# EAGLE schematic tester1 (EAGLE 9.6.2)
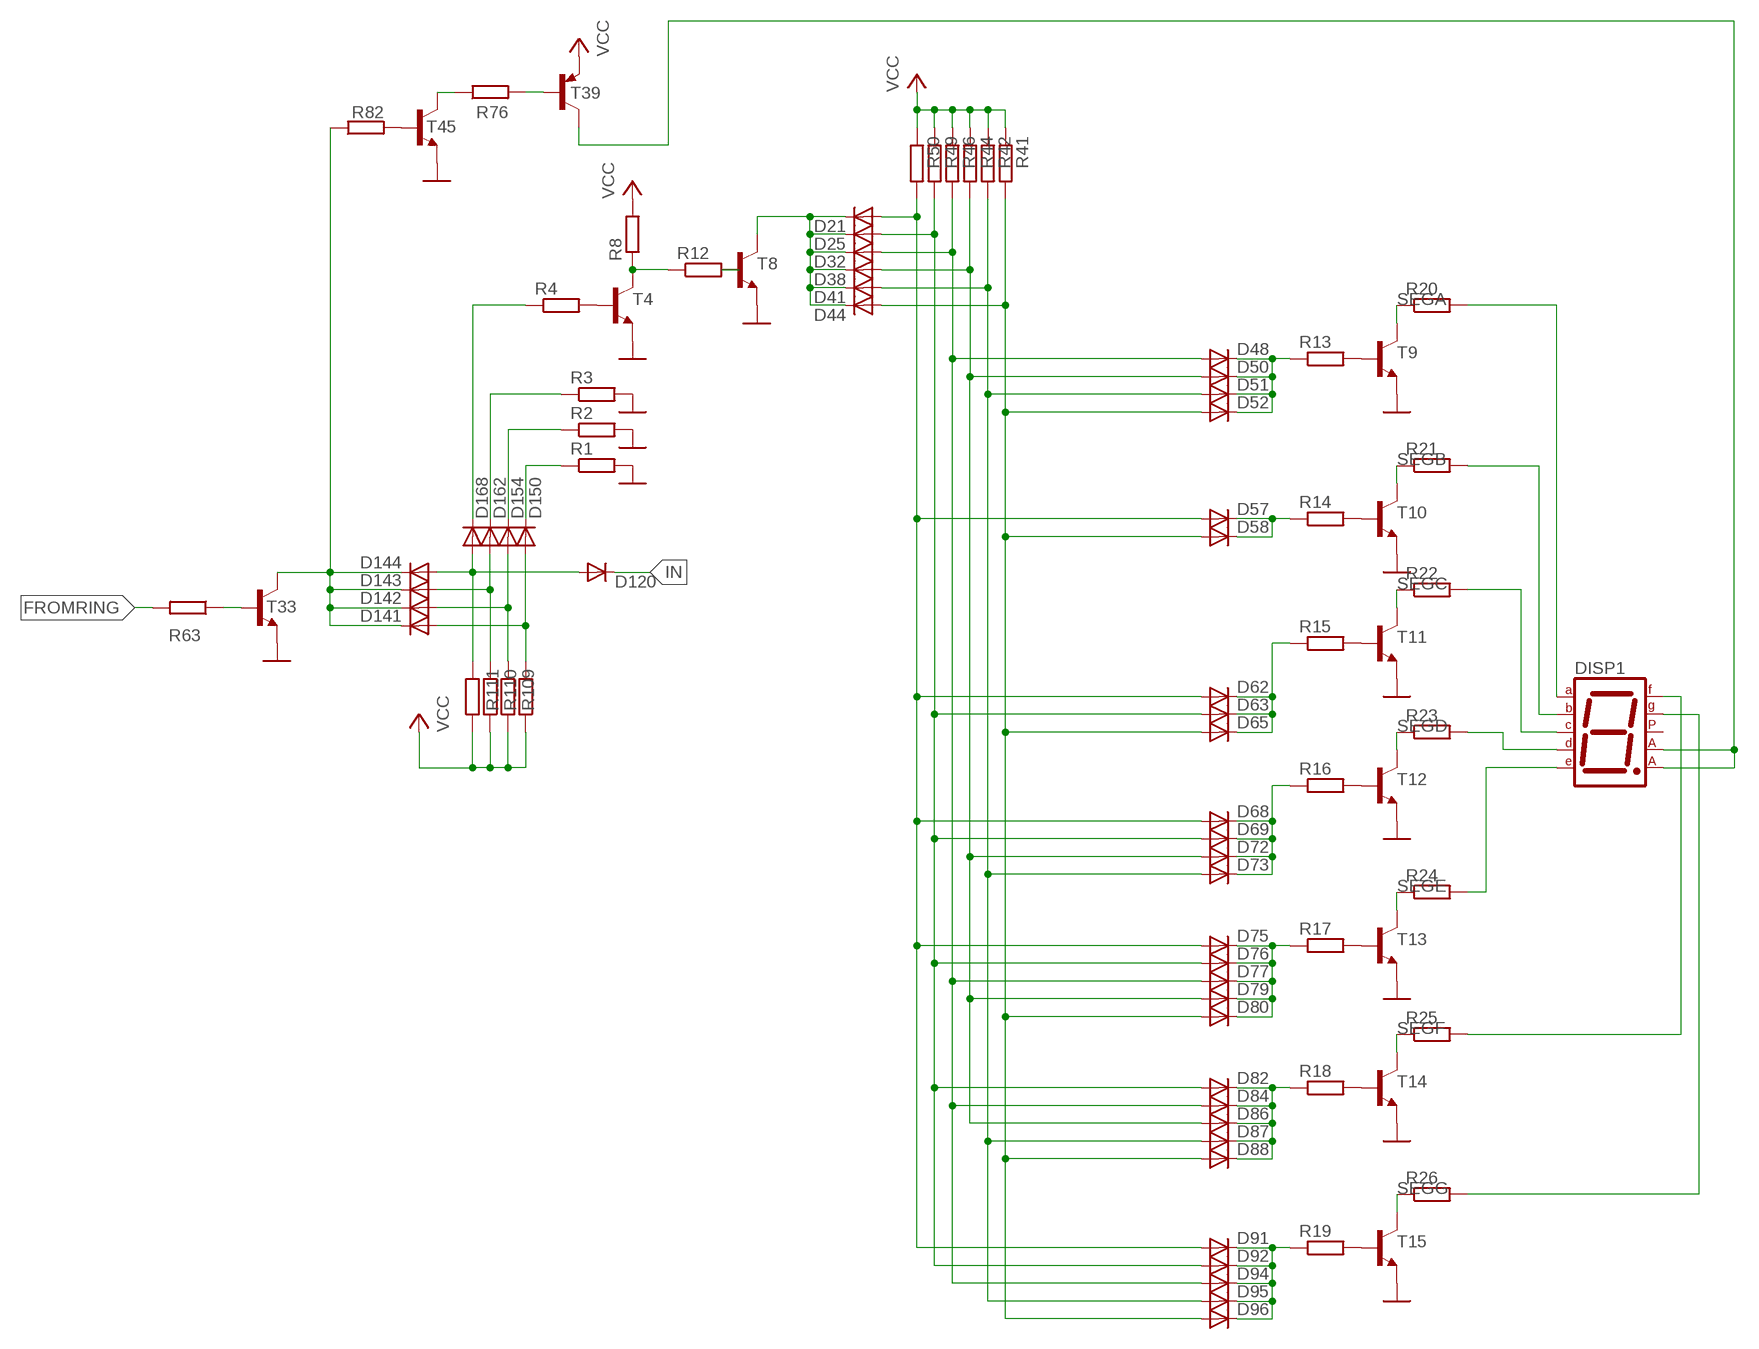
[diagram p0: schematic, sheet 1]

## Parts
D21  SMALL_DIODEDO35-7  [DO35-7]
D25  SMALL_DIODEDO35-7  [DO35-7]
D32  SMALL_DIODEDO35-7  [DO35-7]
D38  SMALL_DIODEDO35-7  [DO35-7]
D41  SMALL_DIODEDO35-7  [DO35-7]
D44  SMALL_DIODEDO35-7  [DO35-7]
D48  SMALL_DIODEDO35-7  [DO35-7]
D50  SMALL_DIODEDO35-7  [DO35-7]
D51  SMALL_DIODEDO35-7  [DO35-7]
D52  SMALL_DIODEDO35-7  [DO35-7]
D57  SMALL_DIODEDO35-7  [DO35-7]
D58  SMALL_DIODEDO35-7  [DO35-7]
D62  SMALL_DIODEDO35-7  [DO35-7]
D63  SMALL_DIODEDO35-7  [DO35-7]
D65  SMALL_DIODEDO35-7  [DO35-7]
D68  SMALL_DIODEDO35-7  [DO35-7]
D69  SMALL_DIODEDO35-7  [DO35-7]
D72  SMALL_DIODEDO35-7  [DO35-7]
D73  SMALL_DIODEDO35-7  [DO35-7]
D75  SMALL_DIODEDO35-7  [DO35-7]
D76  SMALL_DIODEDO35-7  [DO35-7]
D77  SMALL_DIODEDO35-7  [DO35-7]
D79  SMALL_DIODEDO35-7  [DO35-7]
D80  SMALL_DIODEDO35-7  [DO35-7]
D82  SMALL_DIODEDO35-7  [DO35-7]
D84  SMALL_DIODEDO35-7  [DO35-7]
D86  SMALL_DIODEDO35-7  [DO35-7]
D87  SMALL_DIODEDO35-7  [DO35-7]
D88  SMALL_DIODEDO35-7  [DO35-7]
D91  SMALL_DIODEDO35-7  [DO35-7]
D92  SMALL_DIODEDO35-7  [DO35-7]
D94  SMALL_DIODEDO35-7  [DO35-7]
D95  SMALL_DIODEDO35-7  [DO35-7]
D96  SMALL_DIODEDO35-7  [DO35-7]
D120  SMALL_DIODEDO35-7  [DO35-7]
D141  SMALL_DIODEDO35-7  [DO35-7]
D142  SMALL_DIODEDO35-7  [DO35-7]
D143  SMALL_DIODEDO35-7  [DO35-7]
D144  SMALL_DIODEDO35-7  [DO35-7]
D150  SMALL_DIODEDO35-7  [DO35-7]
D154  SMALL_DIODEDO35-7  [DO35-7]
D162  SMALL_DIODEDO35-7  [DO35-7]
D168  SMALL_DIODEDO35-7  [DO35-7]
DISP1  7SEG-CA  [7SEG-13]
R1  RESISTOR7MM  [7MM_RESISTOR]
R2  RESISTOR7MM  [7MM_RESISTOR]
R3  RESISTOR7MM  [7MM_RESISTOR]
R4  RESISTOR7MM  [7MM_RESISTOR]
R8  RESISTOR7MM  [7MM_RESISTOR]
R12  RESISTOR7MM  [7MM_RESISTOR]
R13  RESISTOR7MM  [7MM_RESISTOR]
R14  RESISTOR7MM  [7MM_RESISTOR]
R15  RESISTOR7MM  [7MM_RESISTOR]
R16  RESISTOR7MM  [7MM_RESISTOR]
R17  RESISTOR7MM  [7MM_RESISTOR]
R18  RESISTOR7MM  [7MM_RESISTOR]
R19  RESISTOR7MM  [7MM_RESISTOR]
R20  RESISTOR7MM  [7MM_RESISTOR]
R21  RESISTOR7MM  [7MM_RESISTOR]
R22  RESISTOR7MM  [7MM_RESISTOR]
R23  RESISTOR7MM  [7MM_RESISTOR]
R24  RESISTOR7MM  [7MM_RESISTOR]
R25  RESISTOR7MM  [7MM_RESISTOR]
R26  RESISTOR7MM  [7MM_RESISTOR]
R41  RESISTOR7MM  [7MM_RESISTOR]
R42  RESISTOR7MM  [7MM_RESISTOR]
R44  RESISTOR7MM  [7MM_RESISTOR]
R46  RESISTOR7MM  [7MM_RESISTOR]
R49  RESISTOR7MM  [7MM_RESISTOR]
R50  RESISTOR7MM  [7MM_RESISTOR]
R63  RESISTOR7MM  [7MM_RESISTOR]
R76  RESISTOR7MM  [7MM_RESISTOR]
R82  RESISTOR7MM  [7MM_RESISTOR]
R108  RESISTOR7MM  [7MM_RESISTOR]
R109  RESISTOR7MM  [7MM_RESISTOR]
R110  RESISTOR7MM  [7MM_RESISTOR]
R111  RESISTOR7MM  [7MM_RESISTOR]
T4  BC547B-NPN-TO92-CBE  [TO92-CBE]
T8  BC547B-NPN-TO92-CBE  [TO92-CBE]
T9  BC547B-NPN-TO92-CBE  [TO92-CBE]
T10  BC547B-NPN-TO92-CBE  [TO92-CBE]
T11  BC547B-NPN-TO92-CBE  [TO92-CBE]
T12  BC547B-NPN-TO92-CBE  [TO92-CBE]
T13  BC547B-NPN-TO92-CBE  [TO92-CBE]
T14  BC547B-NPN-TO92-CBE  [TO92-CBE]
T15  BC547B-NPN-TO92-CBE  [TO92-CBE]
T33  BC547B-NPN-TO92-CBE  [TO92-CBE]
T39  BC557B-PNP-TO92-EBC  [TO92-EBC]
T45  BC547B-NPN-TO92-CBE  [TO92-CBE]

## Nets
B3: D21.C D25.C D32.C D38.C D41.C D44.C T8.C
FROMRING: R63.2
GND [PWR]: R1.2 R2.2 R3.2 T4.E T8.E T9.E T10.E T11.E T12.E T13.E T14.E T15.E T33.E T45.E
I10: D32.A D48.A D77.A D84.A D94.A R46.2
I12: D38.A D50.A D72.A D79.A D86.A R44.2
I13: D41.A D51.A D73.A D87.A D95.A R42.2
I14: D44.A D52.A D58.A D65.A D80.A D88.A D96.A R41.2
IN: D120.C
IN2: D162.C R3.1
IN3: D168.C R4.1
N$1: R13.2 T9.B
N$2: DISP1.7(A) R20.2
N$3: R14.2 T10.B
N$4: R15.2 T11.B
N$5: R16.2 T12.B
N$6: R17.2 T13.B
N$7: R18.2 T14.B
N$8: R19.2 T15.B
N$9: DISP1.6(B) R21.2
N$10: DISP1.4(C) R22.2
N$11: DISP1.2(D) R23.2
N$12: DISP1.1(E) R24.2
N$13: DISP1.9(F) R25.2
N$14: DISP1.10(G) R26.2
N$15: R8.1 R12.1 T4.C
N$16: D154.C R2.1
N$17: D150.C R1.1
N$18: D141.C D142.C D143.C D144.C R82.1 T33.C
N$19: DISP1.3(CA1) DISP1.8(CA2) T39.C
N$25: R4.2 T4.B
N$26: R12.2 T8.B
N$67: D141.A D150.A R108.2
N$68: D142.A D154.A R109.2
N$69: D143.A D162.A R110.2
N$70: D120.A D144.A D168.A R111.2
N$85: D21.A D57.A D62.A D68.A D75.A D91.A R50.2
N$87: D25.A D63.A D69.A D76.A D82.A D92.A R49.2
N$98: R63.1 T33.B
N$116: R76.2 T39.B
N$122: R76.1 T45.C
N$129: R82.2 T45.B
ORA: D48.C D50.C D51.C D52.C R13.1
ORB: D57.C D58.C R14.1
ORC: D62.C D63.C D65.C R15.1
ORD: D68.C D69.C D72.C D73.C R16.1
ORE: D75.C D76.C D77.C D79.C D80.C R17.1
ORF: D82.C D84.C D86.C D87.C D88.C R18.1
ORG: D91.C D92.C D94.C D95.C D96.C R19.1
SEGA: R20.1 T9.C
SEGB: R21.1 T10.C
SEGC: R22.1 T11.C
SEGD: R23.1 T12.C
SEGE: R24.1 T13.C
SEGF: R25.1 T14.C
SEGG: R26.1 T15.C
VCC [PWR]: R8.2 R41.1 R42.1 R44.1 R46.1 R49.1 R50.1 R108.1 R109.1 R110.1 R111.1 T39.E
Unconnected: DISP1.5(DP)

## Library data of the parts
D21 D25 D32 D38 D41 D44 D48 D50-D52 D57 D58 D62 D63 D65 D68 D69 D72 D73 D75-D77 D79 D80 D82 D84 D86-D88 D91 D92 D94-D96 D120 D141-D144 D150 D154 D162 D168 = MatsEng:SMALL_DIODE: Small Signal Diode
DISP1 = MatsEng:7SEG-CA: 7-segment DISPLAY single anode, 13 mm
R1-R4 R8 R12-R26 R41 R42 R44 R46 R49 R50 R63 R76 R82 R108-R111 = MatsEng:RESISTOR: Standard resistor, various versions
T4 T8-T15 T33 T45 = MatsEng:*-NPN-: NPN Transistror BF959 corrected 2008.03.06
T39 = MatsEng:*-PNP-: PNP Transistror

## Net classes
0 default: width 0.305 mm, drill 0.4 mm, clearance 0.203 mm
1 PWR: width 0.61 mm, drill 0.4 mm, clearance 0.203 mm